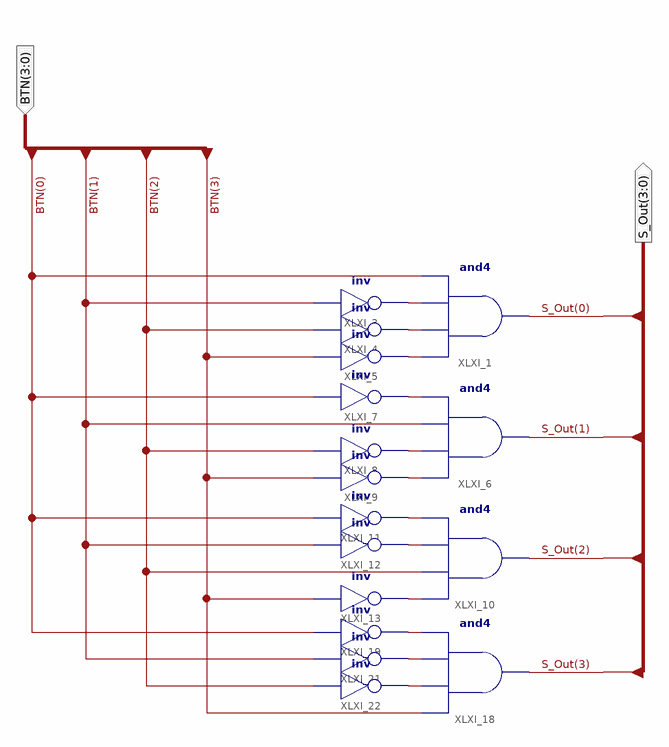
[diagram p0: schematic sheet 1]
// Xilinx ISE schematic allow_one_btn.sch (spartan6) as structural Verilog: 16 symbols, 2 ports
module allow_one_btn (
  input  [3:0] BTN,
  output [3:0] S_Out
);

  wire XLXN_3, XLXN_4, XLXN_5, XLXN_11, XLXN_12, XLXN_13, XLXN_14, XLXN_15, XLXN_16, XLXN_20, XLXN_21,
       XLXN_22;

  and XLXI_1 (S_Out[0], XLXN_5, XLXN_4, XLXN_3, BTN[0]);
  not XLXI_3 (XLXN_3, BTN[1]);
  not XLXI_4 (XLXN_4, BTN[2]);
  not XLXI_5 (XLXN_5, BTN[3]);
  and XLXI_6 (S_Out[1], XLXN_13, XLXN_12, BTN[1], XLXN_11);
  not XLXI_7 (XLXN_11, BTN[0]);
  not XLXI_8 (XLXN_12, BTN[2]);
  not XLXI_9 (XLXN_13, BTN[3]);
  and XLXI_10 (S_Out[2], XLXN_16, BTN[2], XLXN_15, XLXN_14);
  not XLXI_11 (XLXN_14, BTN[0]);
  not XLXI_12 (XLXN_15, BTN[1]);
  not XLXI_13 (XLXN_16, BTN[3]);
  and XLXI_18 (S_Out[3], BTN[3], XLXN_22, XLXN_21, XLXN_20);
  not XLXI_19 (XLXN_20, BTN[0]);
  not XLXI_21 (XLXN_21, BTN[1]);
  not XLXI_22 (XLXN_22, BTN[2]);
endmodule
